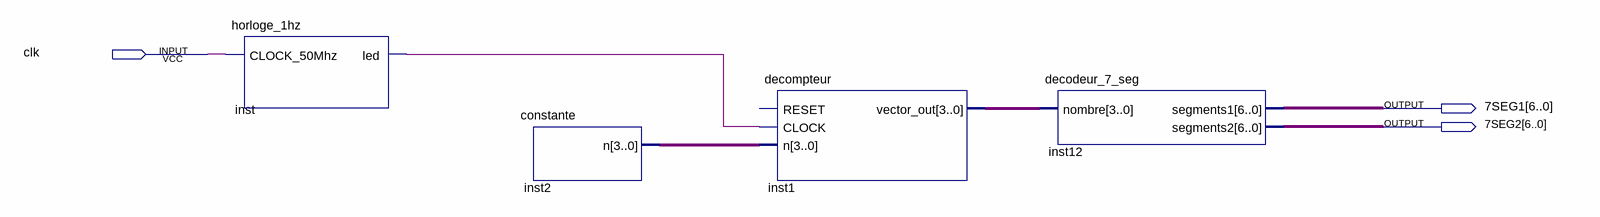
[diagram p0: schematic sheet]
// Quartus schematic affichage_decompteur_modulo_8.bdf as structural Verilog: 4 symbols, 3 pins
module affichage_decompteur_modulo_8 (
  input  clk,
  output [6:0] \7SEG1 ,
  output [6:0] \7SEG2 
);

  wire inst_led;
  wire [3:0] inst1_vector_out, inst2_n;

  horloge_1hz inst (.CLOCK_50Mhz(clk), .led(inst_led));
  constante inst2 (.n(inst2_n));
  decompteur inst1 (.CLOCK(inst_led), .n(inst2_n), .vector_out(inst1_vector_out));  // open: RESET
  decodeur_7_seg inst12 (.nombre(inst1_vector_out), .segments1(\7SEG1 ), .segments2(\7SEG2 ));
endmodule
